# EAGLE design rfid_module_v1 (EAGLE 7.1.0)
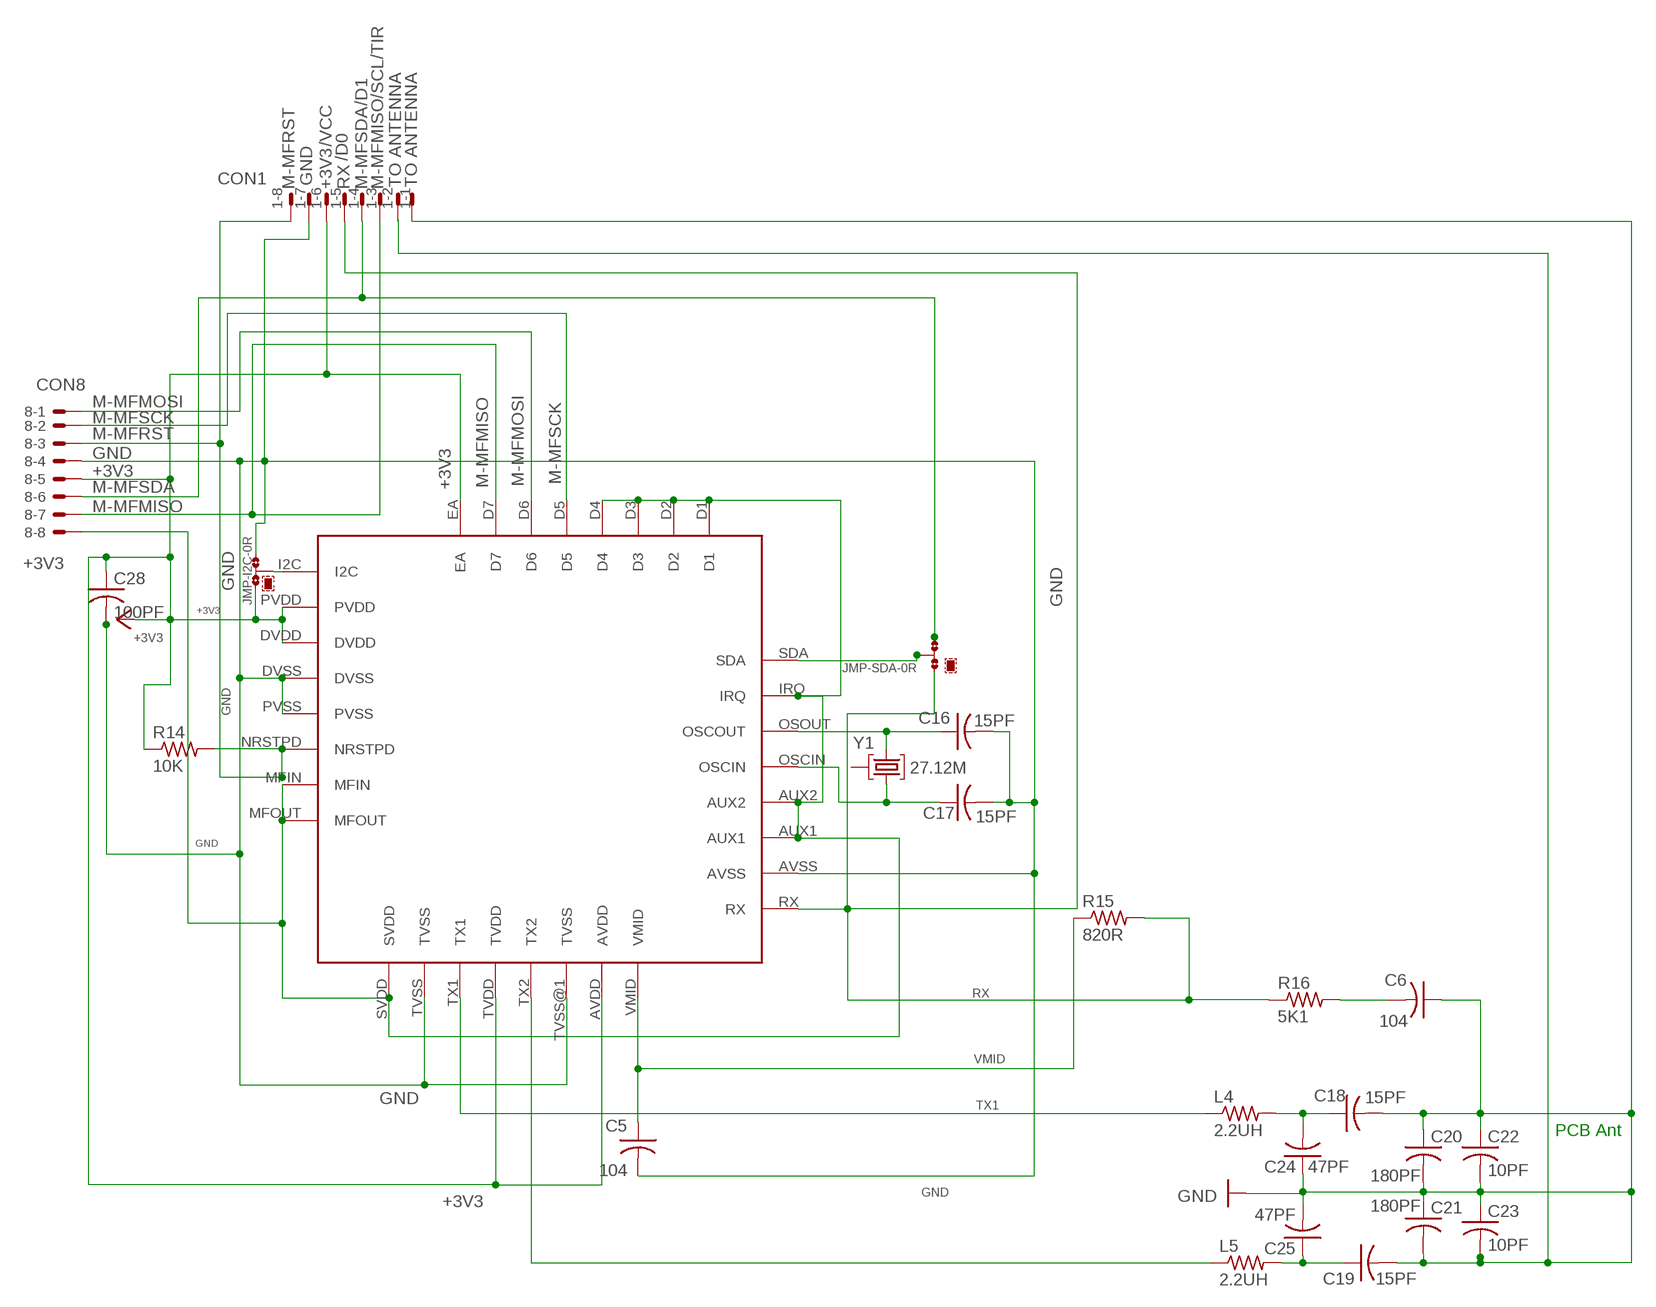
[diagram p0: schematic, sheet 1]

## Parts
1  CON1  22-23-2081  [22-23-2081]
8  CON8  22-23-2081  [22-23-2081]
C5  104  C-USC0603  [C0603]
C6  104  C-USC0603  [C0603]
C16  15PF  C-USC0603  [C0603]
C17  15PF  C-USC0603  [C0603]
C18  15PF  C-USC0603  [C0603]
C19  15PF  C-USC0603  [C0603]
C20  180PF  C-USC0603  [C0603]
C21  180PF  C-USC0603  [C0603]
C22  10PF  C-USC0603  [C0603]
C23  10PF  C-USC0603  [C0603]
C24  47PF  C-USC0603  [C0603]
C25  47PF  C-USC0603  [C0603]
C28  100PF  C-USC0603  [C0603]
JMP-I2C  0R-JUMPA  [A0R-JMP]
JMP-SDA  0R-JUMPA  [A0R-JMP]
L4  2.2UH  R-US_R0603  [R0603]
L5  2.2UH  R-US_R0603  [R0603]
R14  10K  R-US_R0603  [R0603]
R15  820R  R-US_R0603  [R0603]
R16  5K1  R-US_R0603  [R0603]
U$1  MFRC522  [MFRC522]
Y1  27.12M  CRYSTAL  [RAD3LEAD]

## Nets
+3V3: 1.6 8.5 C28.1 JMP-I2C.3 R14.1 U$1.AVDD U$1.DVDD U$1.EA U$1.PVDD U$1.TVDD ; supply symbol labelled +3.3V
GND: 1.1 1.7 8.4 C5.2 C6.1 C16.2 C17.2 C18.2 C19.2 C20.1 C20.2 C21.1 C21.2 C22.1 C22.2 C23.1 C23.2 C24.1 C25.2 C28.2 JMP-I2C.1 U$1.AVSS U$1.DVSS U$1.PVSS U$1.TVSS U$1.TVSS@1(TVSS)
M-MFMISO: 1.3 8.7 U$1.D7
M-MFMOSI: 8.1 U$1.D6
M-MFRST: 1.8 8.3 R14.2 U$1.NRSTPD
M-MFSCK: 8.2 U$1.D5
M-MFSDA: 1.4 8.6 JMP-SDA.3
N$1: C16.1 U$1.OSOUT(OSCOUT) Y1.3
N$2: C18.1 C24.2 L4.2
N$3: C17.1 U$1.OSCIN Y1.1
N$4: 8.8 U$1.AUX1 U$1.AUX2 U$1.D1 U$1.D2 U$1.D3 U$1.D4 U$1.IRQ U$1.MFIN U$1.MFOUT U$1.SVDD
N$5: JMP-SDA.2 U$1.SDA
N$6: C19.1 C25.1 L5.2
N$7: JMP-I2C.2 U$1.I2C
N$8: L5.1 U$1.TX2
N$10: C6.2 R16.2
RX: 1.5 JMP-SDA.1 R15.2 R16.1 U$1.RX
TX1: L4.1 U$1.TX1
VMID: C5.1 R15.1 U$1.VMID
Unconnected: 1.2 Y1.2

## Notes on the sheet
- /SCL/TIR
- /D1
- /VCC
- /D0
- TO ANTENNA | TO ANTENNA
- PCB Ant

## Library data of the parts
1 8 = con-molex:22-23-2081: .100" (2.54mm) Center Header - 8 Pin; MF: MOLEX; MPN: 22-23-2081; OC_FARNELL: 1756826; OC_NEWARK: 01C7592
C5 C6 C16-C25 C28 = resistor:C-US: CAPACITOR, American symbol
JMP-I2C JMP-SDA = jump-0r-smd:0R-JUMP: SMD 0R 0805 Jumper
L4 L5 R14-R16 = resistor:R-US_: RESISTOR, American symbol
U$1 = mfrc522:MFRC522
Y1 = RFID Reader Part Library (1):CRYSTAL

## Board
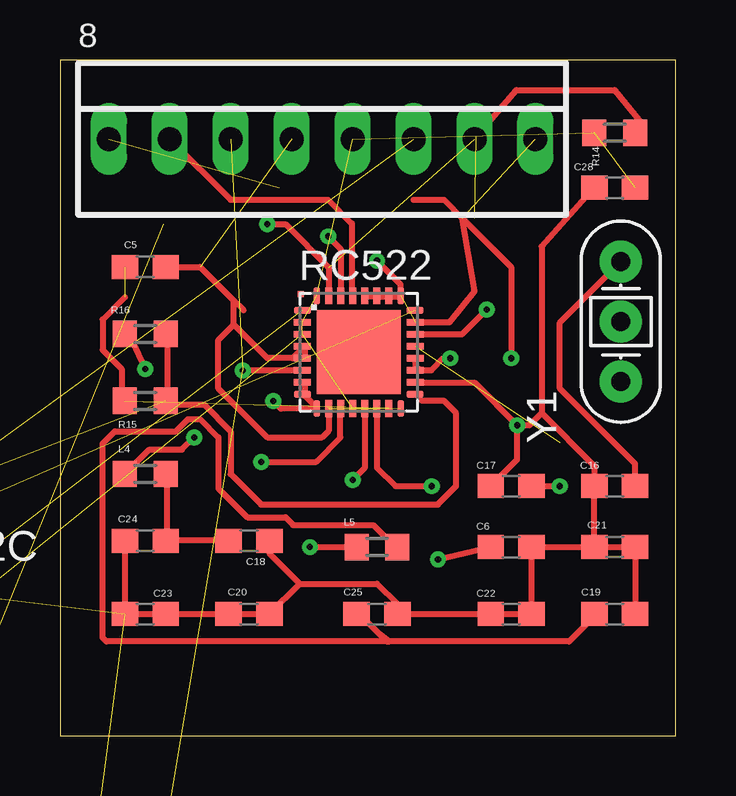
[diagram p1: board, top side]
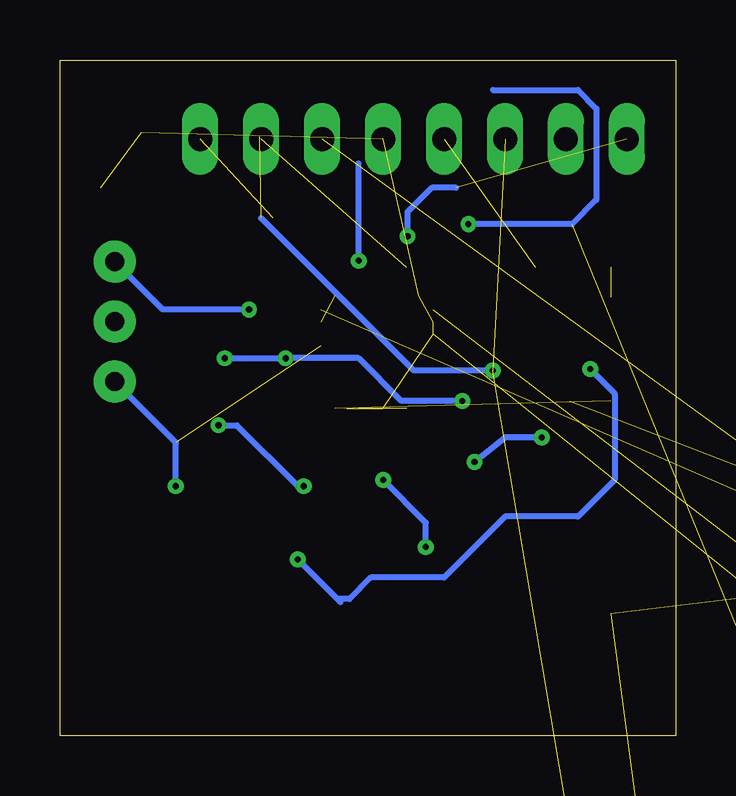
[diagram p2: board, bottom side, seen from below]

Size 25.65 x 28.18 mm. Coordinates in mm from the lower left corner, seen from the top.
Outline: 0,0 25.65,0 25.65,28.18 0,28.18 0,0
Copper layers (1*16): Top 0.035mm / dielectric 1.5mm / Bottom 0.035mm
Design rules "default": minimum track width 10mil, minimum drill 24mil, track to track 8mil, track to pad 8mil, pad to pad 8mil, via to via 8mil, smd to smd 8mil, copper to edge 40mil, drill to drill 8mil, minimum pad ring 10mil, minimum via ring 8mil, stop-mask expansion 4mil, vias tented up to drill 0mil, thermal gap 10mil

### Footprints (pad centres in the part's own frame; a part is rotated, then mirrored left to right if it is on the bottom)
22-23-2081 = drill 1 long: 1 -8.89,0; 2 -6.35,0; 3 -3.81,0; 4 -1.27,0; 5 1.27,0; 6 3.81,0; 7 6.35,0; 8 8.89,0
C0603 = smd 1.1 x 1: 1 -0.85,0; 2 0.85,0
A0R-JMP = smd 1.5 x 1.3: 1 0,1.7; 2 0,0; 3 0,-1.7
R0603 = smd 1 x 1.1: 1 -0.85,0; 2 0.85,0
MFRC522 = smd 0.7 x 0.28: AUX1 2.35,-0.75; AUX2 2.35,-0.25; AVSS 2.35,-1.25; DVDD -2.35,0.75; DVSS -2.35,0.25; I2C -2.35,1.75; IRQ 2.35,1.25; MFIN -2.35,-1.25; MFOUT -2.35,-1.75; NRSTPD -2.35,-0.75; OSCIN 2.35,0.25; OSOUT 2.35,0.75; PVDD -2.35,1.25; PVSS -2.35,-0.25; RX 2.35,-1.75; SDA 2.35,1.75 | smd 0.28 x 0.7: AVDD 1.25,-2.35; D1 1.75,2.35; D2 1.25,2.35; D3 0.75,2.35; D4 0.25,2.35; D5 -0.25,2.35; D6 -0.75,2.35; D7 -1.25,2.35; EA -1.75,2.35; SVDD -1.75,-2.35; TVDD -0.25,-2.35; TVSS -1.25,-2.35; TVSS@1 0.75,-2.35; TX1 -0.75,-2.35; TX2 0.25,-2.35; VMID 1.75,-2.35 | smd 3.5 x 3.5: EXP 0,0 | smd 0.25 x 0.25: M1 -2.415,2.415
RAD3LEAD = drill 0.8 pad 1.75: 1 -2.5,0; 2 0,0; 3 2.5,0

### Placement (x,y rotation side)
1  -6.1,-13.46 0 top  (outside the outline)
8  10.92,24.89 0 top
C5  3.56,19.56 0 top
C6  18.8,7.87 180 top
C16  23.11,10.41 180 top
C17  18.8,10.41 180 top
C18  7.87,8.13 0 top
C19  23.11,5.08 0 top
C20  7.87,5.08 0 top
C21  23.11,7.87 0 top
C22  18.8,5.08 180 top
C23  3.56,5.08 180 top
C24  3.56,8.13 0 top
C25  13.21,5.08 0 top
C28  23.11,22.86 180 top
JMP-I2C  -7.11,4.57 0 top  (outside the outline)
JMP-SDA  -15.49,4.57 0 top  (outside the outline)
L4  3.56,10.92 0 top
L5  13.21,7.87 0 top
R14  23.11,25.15 0 top
R15  3.56,13.97 0 top
R16  3.56,16.76 180 top
U$1  12.45,16 0 top
Y1  23.37,17.27 90 top

### Tracks (layer width: path | path; a pad name or v marks a point on that pad's centre or on a via)
+3V3  (9 unrouted)
GND  (via drill 0.25)  (5 unrouted)
  Top 0.254: 10.19,16.26 10.19,15.78 U$1.PVSS | 10.19,16.26 U$1.DVSS | C5.2 5.84,19.56 7.24,18.16 | 7.24,18.16 7.65,17.75 | 10.19,16.26 9.68,15.75 8.64,15.75 7.24,17.14 | 7.24,17.14 7.24,18.16 | 7.24,17.14 6.6,16.51 6.6,14.48 8.64,12.45 10.92,12.45 11.2,12.72 U$1.TVSS | 20.07,13.46 20.07,20.41 C28.2 | 20.07,13.46 19.56,12.95 v19.05,12.95 | U$1.AVSS 14.82,14.73 17.27,14.73 v19.05,12.95 | U$1.TVSS@1 13.21,13.64 13.21,11.18 13.97,10.41 v15.49,10.41 | C17.2 19.05,11.52 v19.05,12.95 | 20.07,13.46 22.26,11.26 C16.2 C21.1 | C24.1 C23.2 C23.1 C20.1 C20.2 9.99,6.35 | 9.99,6.35 13.21,6.35 14.06,5.5 C25.2 C22.2 C22.1 C6.1 C21.1 | C21.1 C21.2 C19.2 | 9.99,6.35 8.72,7.62 C18.2
  Bottom 0.254: v19.05,12.95 18.29,12.95 15.75,10.41 v15.49,10.41
M-MFMISO  (via drill 0.25)  (2 unrouted)
  Top 0.254: v8.64,21.34 9.4,21.34 11.2,19.54 U$1.D7
  Bottom 0.254: 7.62,26.92 4.06,26.92 3.3,26.16 3.3,22.35 4.32,21.34 v8.64,21.34
M-MFMOSI  (via drill 0.25)  (1 unrouted)
  Top 0.254: v11.18,20.83 11.7,20.31 U$1.D6
  Bottom 0.254: 9.14,22.86 10.16,22.86 11.18,21.84 v11.18,20.83
M-MFRST  (via drill 0.25)  (3 unrouted)
  Top 0.254: U$1.NRSTPD 10.08,15.24 v7.62,15.24 | 17.34,24.99 19.02,26.92 23.11,26.92 24.22,25.57 R14.2
  Bottom 0.254: v7.62,15.24 10.92,15.24 17.27,21.59
M-MFSCK
  Top 0.254: U$1.D5 12.17,18.52 12.17,21.36 11.18,22.35 7.11,22.35 8.2
M-MFSDA  (2 unrouted)
N$1  (via drill 0.25)
  Top 0.254: U$1.OSOUT 16.75,16.75 v17.78,17.78 | C16.1 23.96,11.34 20.83,14.48 20.83,17.23 Y1.3
  Bottom 0.254: v17.78,17.78 21.38,17.78 Y1.3
N$2
  Top 0.254: 4.48,8.16 7.02,8.16 C18.1 | 4.48,8.16 4.48,10.86 L4.2 | 4.48,8.16 C24.2
N$3  (via drill 0.25)  (1 unrouted)
  Top 0.254: C17.1 v20.83,10.41
  Bottom 0.254: v20.83,10.41 20.83,12.19 20.83,12.23 Y1.1
N$4  (via drill 0.25)  (2 unrouted)
  Top 0.254: U$1.MFIN 10.19,14.67 10.19,14.35 U$1.MFOUT 10.19,14.19 10.67,13.72 U$1.SVDD 9.21,13.65 v8.89,13.97 | 13.21,18.32 12.73,18.32 U$1.D4 | 13.21,18.32 13.68,18.32 | 13.21,18.32 U$1.D3 | 13.68,18.32 14.16,18.32 U$1.D1 14.2,18.82 v13.21,19.81 | 13.68,18.32 U$1.D2 | U$1.AUX1 14.8,15.3 14.8,15.62 U$1.AUX2 | 14.95,15.3 U$1.AUX1 | U$1.AUX1 15.48,15.25 15.98,15.75 v16.26,15.75 | U$1.IRQ 16.24,17.25 17.27,18.54 16.76,21.59 | 14.73,22.35 16,22.35 16.76,21.59 | 16.76,21.59 18.8,19.56 v18.8,15.75
  Bottom 0.254: v13.21,19.81 13.21,23.88 | v18.8,15.75 v16.26,15.75 13.21,15.75 11.43,13.97 v8.89,13.97
N$5  (1 unrouted)
N$6
  Top 0.254: 13.62,3.94 13.29,4.27 | 13.29,4.27 12.57,4.98 12.41,4.98 C25.1 | 13.72,3.94 21.21,3.94 22.26,4.98 C19.1 | 13.72,3.94 13.62,3.94 | 13.62,3.94 1.94,3.94 1.78,4.1 1.78,12.19 2.29,12.7 4.83,12.7 5.33,13.21 5.84,13.21 6.6,12.45 6.6,10.32 7.81,9.11 9.4,9.11 9.71,8.79 13.05,8.79 13.84,8 14,8 L5.2 | 13.72,3.94 13.29,4.27
N$7  (1 unrouted)
N$8  (via drill 0.25)
  Top 0.254: v10.41,7.87 L5.1 | U$1.TX2 12.7,11.17 v12.19,10.67
  Bottom 0.254: v10.41,7.87 10.41,8.89 v12.19,10.67
N$10  (via drill 0.25)
  Top 0.254: v3.56,15.3 2.89,16.73 2.73,16.73 R16.2 | v15.75,7.37 C6.2
  Bottom 0.254: 13.97,5.59 14.1,5.71 | 14.1,5.71 v15.75,7.37 | v3.56,15.3 2.54,14.29 2.54,10.67 4.06,9.14 7.11,9.14 9.65,6.6 12.7,6.6 13.59,5.71 14.1,5.71
RX  (2 unrouted)
  Top 0.254: 14.95,14.19 U$1.RX 15.08,13.97 16,13.97 16.51,13.46 16.51,10.41 15.75,9.65 8.38,9.65 7.11,10.92 7.11,12.7 6,13.81 4.48,13.81 4.48,14.04 | R16.1 4.48,16.89 4.48,14.04 | 4.48,14.03 R15.2 4.48,14.04
TX1  (via drill 0.25)
  Top 0.254: v8.38,11.43 10.67,11.43 11.68,12.45 11.68,13.64 U$1.TX1 | L4.1 3.72,11.94 5.08,11.94 v5.59,12.45
  Bottom 0.254: v5.59,12.45 7.11,12.45 v8.38,11.43
VMID  (2 unrouted)
  Top 0.254: R15.1 2.57,14.03 2.57,15.3 1.78,16.1 1.78,17.37 2.71,18.3